# Altium project 7LED_DISPLAY.PrjPcb
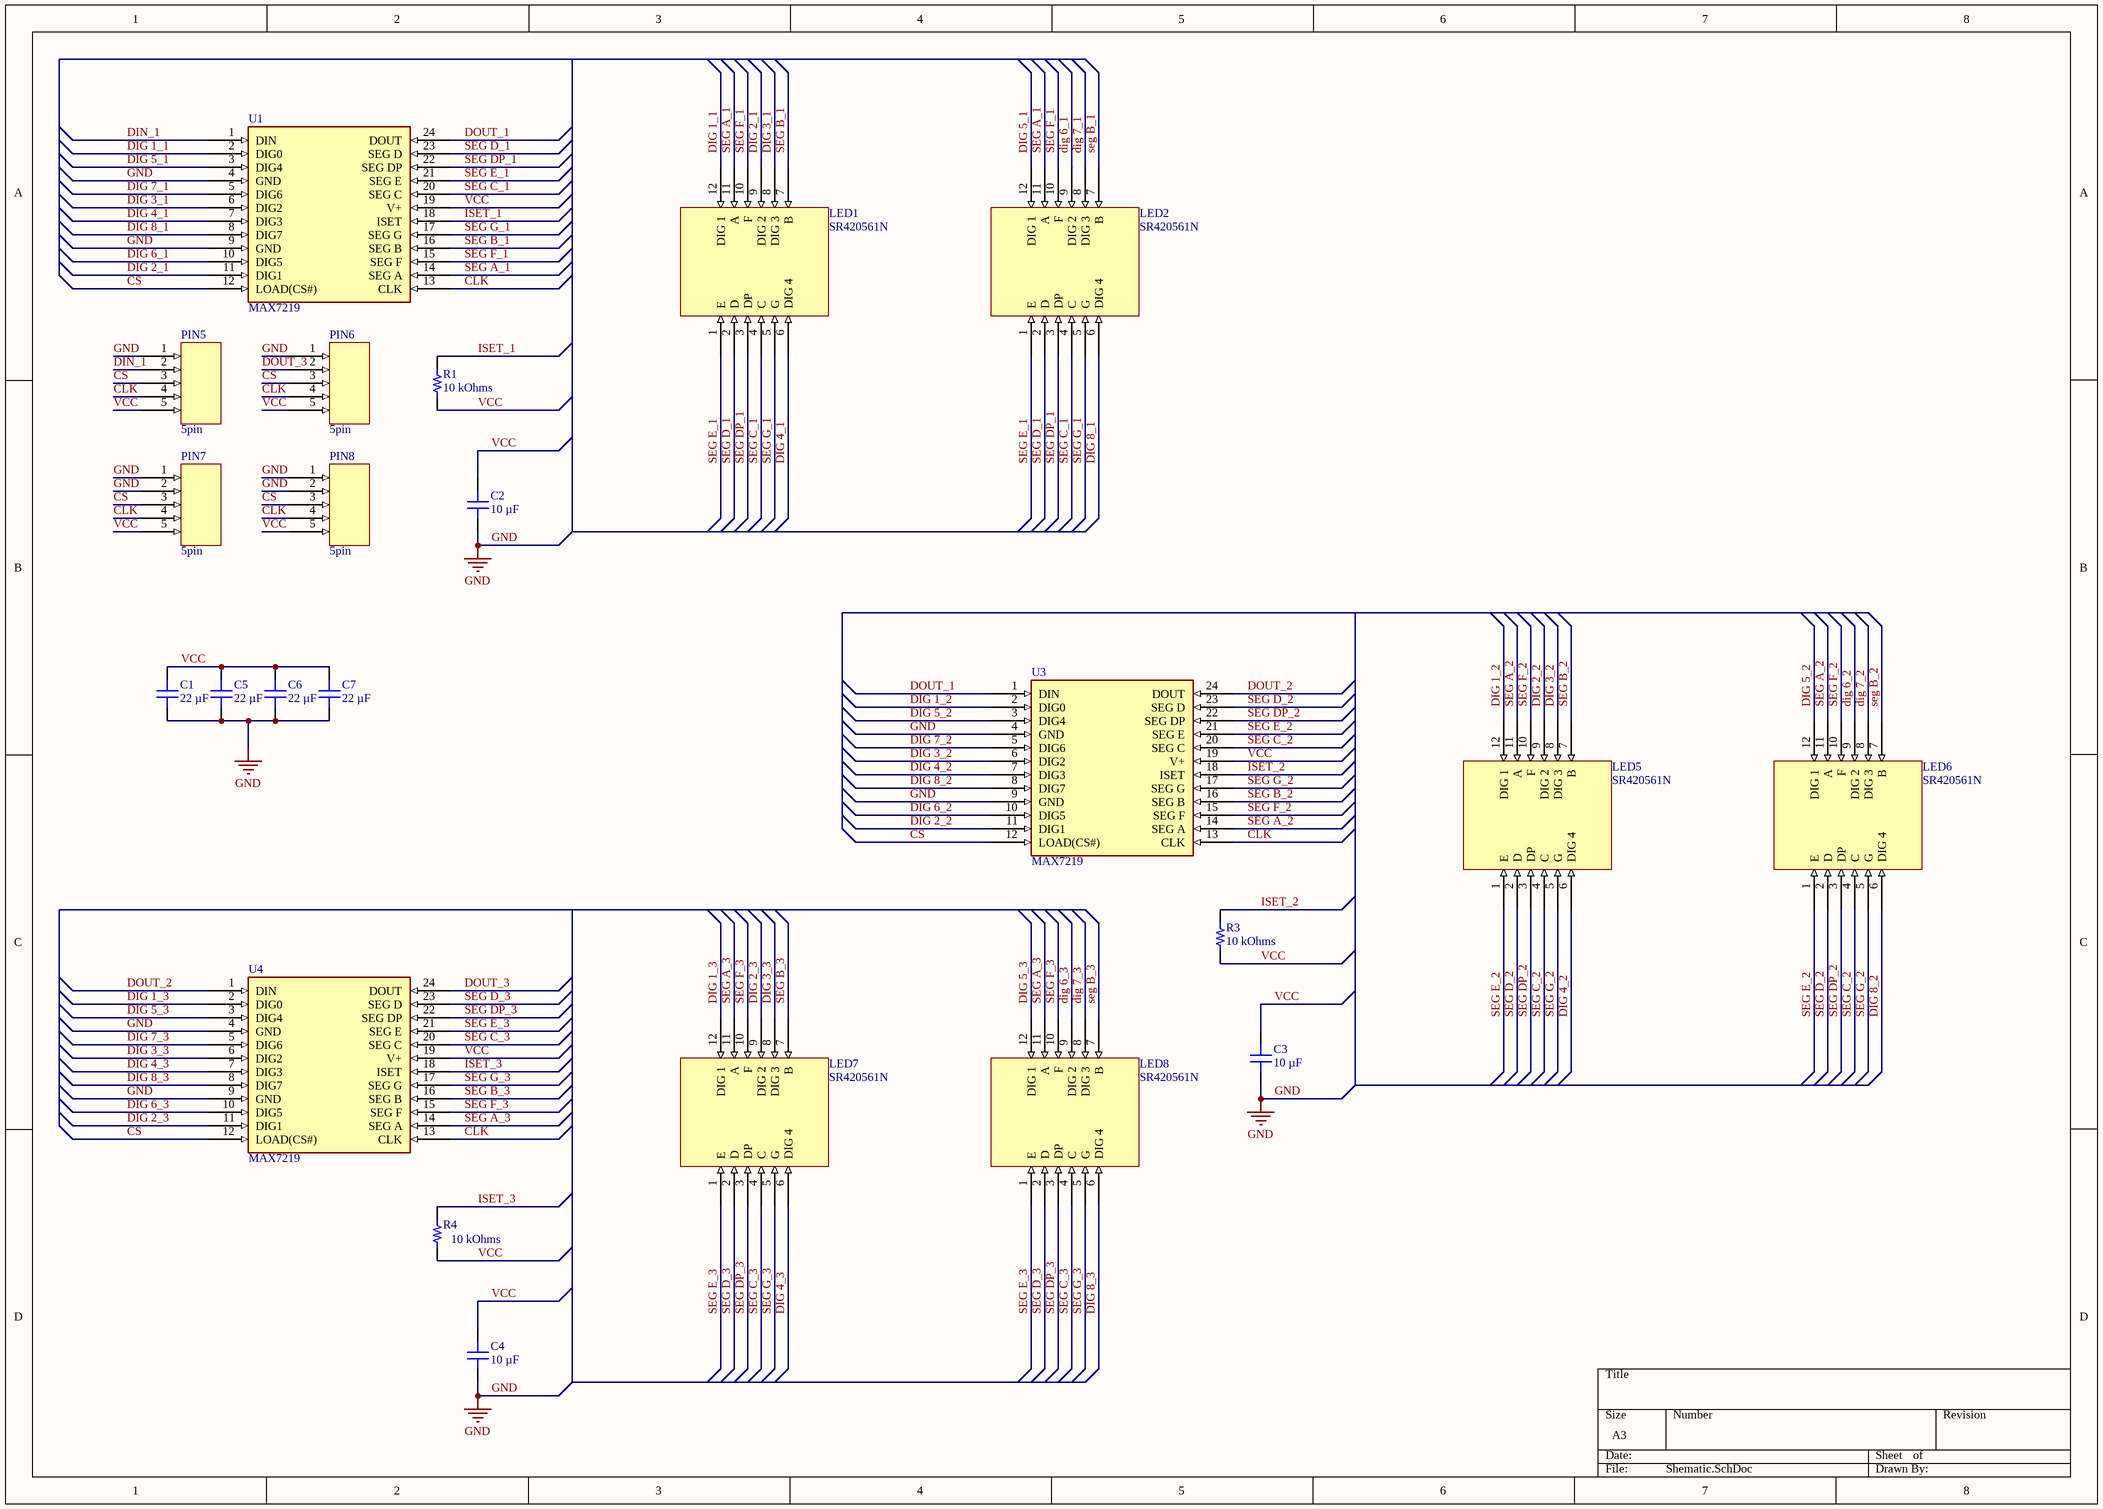
[diagram p0: Shematic.SchDoc]
1 sheet, 23 parts. Net scope: global (net labels, ports and power ports of the same name join across sheets).
Board file: PCB.PcbDoc

## Sheet Shematic.SchDoc
size A3; SheetNumber: 1; SheetTotal: 1

### Parts
C1  22 µF  [CAP 0402_1005]
C2  10 µF  [CAP 0402_1005]
C3  10 µF  [CAP 0402_1005]
C4  10 µF  [CAP 0402_1005]
C5  22 µF  [CAP 0402_1005]
C6  22 µF  [CAP 0402_1005]
C7  22 µF  [CAP 0402_1005]
LED1  SR420561N  [SR420561N]
LED2  SR420561N  [SR420561N]
LED5  SR420561N  [SR420561N]
LED6  SR420561N  [SR420561N]
LED7  SR420561N  [SR420561N]
LED8  SR420561N  [SR420561N]
PIN5  5pin  [PCBComponent_1]
PIN6  5pin  [PCBComponent_1]
PIN7  5pin  [PCBComponent_1]
PIN8  5pin  [PCBComponent_1]
R1  10 kOhms  [RES 0402_1005]
R3  10 kOhms  [RES 0402_1005]
R4  10 kOhms  [RES 0402_1005]
U1  MAX7219  [SO24]
U3  MAX7219  [SO24]
U4  MAX7219  [SO24]

### Nets
GND: C1.1 C2.1 C3.1 C4.1 C5.1 C6.1 C7.1 PIN5.1 PIN6.1 PIN7.1 PIN7.2 PIN8.1 PIN8.2 U1.4(GND) U1.9(GND) U3.4(GND) U3.9(GND) U4.4(GND) U4.9(GND)
CLK: PIN5.4 PIN6.4 PIN7.4 PIN8.4 U1.13(CLK) U3.13(CLK) U4.13(CLK)
CS: PIN5.3 PIN6.3 PIN7.3 PIN8.3 U1.12(LOAD(CS#)) U3.12(LOAD(CS#)) U4.12(LOAD(CS#))
DIG 1_1: LED1.12(DIG_1) U1.2(DIG0)
DIG 1_2: LED5.12(DIG_1) U3.2(DIG0)
DIG 1_3: LED7.12(DIG_1) U4.2(DIG0)
DIG 2_1: LED1.9(DIG_2) U1.11(DIG1)
DIG 2_2: LED5.9(DIG_2) U3.11(DIG1)
DIG 2_3: LED7.9(DIG_2) U4.11(DIG1)
DIG 3_1: LED1.8(DIG_3) U1.6(DIG2)
DIG 3_2: LED5.8(DIG_3) U3.6(DIG2)
DIG 3_3: LED7.8(DIG_3) U4.6(DIG2)
DIG 4_1: LED1.6(DIG_4) U1.7(DIG3)
DIG 4_2: LED5.6(DIG_4) U3.7(DIG3)
DIG 4_3: LED7.6(DIG_4) U4.7(DIG3)
DIG 5_1: LED2.12(DIG_1) U1.3(DIG4)
DIG 5_2: LED6.12(DIG_1) U3.3(DIG4)
DIG 5_3: LED8.12(DIG_1) U4.3(DIG4)
DIG 6_1: LED2.9(DIG_2) U1.10(DIG5)
DIG 6_2: LED6.9(DIG_2) U3.10(DIG5)
DIG 6_3: LED8.9(DIG_2) U4.10(DIG5)
DIG 7_1: LED2.8(DIG_3) U1.5(DIG6)
DIG 7_2: LED6.8(DIG_3) U3.5(DIG6)
DIG 7_3: LED8.8(DIG_3) U4.5(DIG6)
DIG 8_1: LED2.6(DIG_4) U1.8(DIG7)
DIG 8_2: LED6.6(DIG_4) U3.8(DIG7)
DIG 8_3: LED8.6(DIG_4) U4.8(DIG7)
DIN_1: PIN5.2 U1.1(DIN)
DOUT_1: U1.24(DOUT) U3.1(DIN)
DOUT_2: U3.24(DOUT) U4.1(DIN)
DOUT_3: PIN6.2 U4.24(DOUT)
ISET_1: R1.2 U1.18(ISET)
ISET_2: R3.2 U3.18(ISET)
ISET_3: R4.2 U4.18(ISET)
SEG A_1: LED1.11(A) LED2.11(A) U1.14(SEG_A)
SEG A_2: LED5.11(A) LED6.11(A) U3.14(SEG_A)
SEG A_3: LED7.11(A) LED8.11(A) U4.14(SEG_A)
SEG B_1: LED1.7(B) LED2.7(B) U1.16(SEG_B)
SEG B_2: LED5.7(B) LED6.7(B) U3.16(SEG_B)
SEG B_3: LED7.7(B) LED8.7(B) U4.16(SEG_B)
SEG C_1: LED1.4(C) LED2.4(C) U1.20(SEG_C)
SEG C_2: LED5.4(C) LED6.4(C) U3.20(SEG_C)
SEG C_3: LED7.4(C) LED8.4(C) U4.20(SEG_C)
SEG D_1: LED1.2(D) LED2.2(D) U1.23(SEG_D)
SEG D_2: LED5.2(D) LED6.2(D) U3.23(SEG_D)
SEG D_3: LED7.2(D) LED8.2(D) U4.23(SEG_D)
SEG DP_1: LED1.3(DP) LED2.3(DP) U1.22(SEG_DP)
SEG DP_2: LED5.3(DP) LED6.3(DP) U3.22(SEG_DP)
SEG DP_3: LED7.3(DP) LED8.3(DP) U4.22(SEG_DP)
SEG E_1: LED1.1(E) LED2.1(E) U1.21(SEG_E)
SEG E_2: LED5.1(E) LED6.1(E) U3.21(SEG_E)
SEG E_3: LED7.1(E) LED8.1(E) U4.21(SEG_E)
SEG F_1: LED1.10(F) LED2.10(F) U1.15(SEG_F)
SEG F_2: LED5.10(F) LED6.10(F) U3.15(SEG_F)
SEG F_3: LED7.10(F) LED8.10(F) U4.15(SEG_F)
SEG G_1: LED1.5(G) LED2.5(G) U1.17(SEG_G)
SEG G_2: LED5.5(G) LED6.5(G) U3.17(SEG_G)
SEG G_3: LED7.5(G) LED8.5(G) U4.17(SEG_G)
VCC: C1.2 C2.2 C3.2 C4.2 C5.2 C6.2 C7.2 PIN5.5 PIN6.5 PIN7.5 PIN8.5 R1.1 R3.1 R4.1 U1.19(V+) U3.19(V+) U4.19(V+)

### Library data of the parts
C1 C5-C7 = CL05A226MQ6ZUN8: CAP CER 22UF 6.3V X5R 0402; manufacturer: Samsung Electro-Mechanics; Tolerance: ±20%; Part Number: CL05A226MQ6ZUN8; Value: 22 µF; Applications: Boardflex Sensitive; Capacitance: 22 µF; componentlink1description: Datasheet; componentlink1url: http://www.samsungsem.com/kr/support/library/product-catalog/mlcc.jsp; componentlink2description: DigiKey Link; componentlink2url: https://www.digikey.com/en/products/detail/samsung-electro-mechanics/CL05A226MQ6ZUN8/5961288; Device Package: 0402 (1005 Metric); Features: Soft Termination; lastupdated: 07.08.2023 19:04:38; Lifecycle Status: Active; Minimum Order: 1; Mounting Type: Surface Mount, MLCC; Operating Temperature: -55°C ~ 85°C; Package / Case: 0402 (1005 Metric); packaging: TapeAndReel; partid: 5105; Part Status: Active; price: 0.35; series: CL; Size / Dimension: 0.039" L x 0.020" W (1.00mm x 0.50mm); Supplier 1: DigiKey; Supplier Part Number 1: 1276-6804-1-ND; Temperature Coefficient: X5R; Thickness (Max): 0.031" (0.80mm); Voltage - Rated: 6.3V
C2-C4 = CL05A106MQ5NUNC: CAP CER 10UF 6.3V X5R 0402; manufacturer: Samsung Electro-Mechanics; Tolerance: ±20%; Part Number: CL05A106MQ5NUNC; Value: 10 µF; Applications: General Purpose; Capacitance: 10 µF; componentlink1description: Datasheet; componentlink1url: http://www.samsungsem.com/kr/support/product-search/mlcc/CL05A106MQ5NUNC.jsp; componentlink2description: DigiKey Link; componentlink2url: https://www.digikey.com/en/products/detail/samsung-electro-mechanics/CL05A106MQ5NUNC/3887109; Device Package: 0402 (1005 Metric); lastupdated: 03.01.2023 20:04:20; Lifecycle Status: Active; Minimum Order: 1; Mounting Type: Surface Mount, MLCC; Operating Temperature: -55°C ~ 85°C; Package / Case: 0402 (1005 Metric); packaging: TapeAndReel; partid: 1766; Part Status: Active; price: 0.03; series: CL; Size / Dimension: 0.039" L x 0.020" W (1.00mm x 0.50mm); Supplier 1: DigiKey; Supplier Part Number 1: 1276-1451-1-ND; Temperature Coefficient: X5R; Thickness (Max): 0.028" (0.70mm); Voltage - Rated: 6.3V
PIN5-PIN8 = 5_pin
R1 R3 R4 = RC0402JR-0710KP: RES SMD 10K OHM 5% 1/16W 0402; Manufacturer: Yageo; Power (Watts): 0.063W, 1/16W; Temperature Coefficient: ±150ppm/°C; Part Number: RC0402JR-0710KP; Value: 10 kOhms; ComponentLink1Description: Datasheet; ComponentLink1URL: http://www.yageo.com/NewPortal/yageodocoutput?fileName=/pdf/R-Chip/PYu-RC_51_RoHS_P_0.pdf; ComponentLink2Description: DigiKey Link; ComponentLink2URL: https://www.digikey.com/en/products/detail/yageo/RC0402JR-0710KP/4935296; Composition: Thick Film; Device Package: 0402 (1005 Metric); Features: Moisture Resistant; Height - Seated (Max): 0.016" (0.40mm); LastUpdated: 02.01.2023 20:21:12; Lifecycle Status: Active; Minimum Order: 1; Number of Terminations: 2; Operating Temperature: -55°C ~ 155°C; Package / Case: 0402 (1005 Metric); Packaging: CutTape; PartId: 11464; Part Status: Active; Price: 0.01; Resistance: 10 kOhms; Series: RC-P Lead Free; Size / Dimension: 0.039" L x 0.020" W (1.00mm x 0.50mm); Supplier 1: DigiKey; Supplier Part Number 1: YAG1281CT-ND; Supplier Device Package: 0402; Tolerance: ±5%
U1 U3 U4 = MAX7219EWG